# Altium schematic sheet [10]-LPDDR4 SDRAM-2.SchDoc: RK3399 SOM Board Design V1.0
size A3; Author: ABC; Organization: Altium Limited; Address1: L3, 12a Rodborough Rd; Address2: Frenchs Forest; Address3: NSW; Address4: Australia 2086; DocumentNumber: 12; SheetNumber: 12; SheetTotal: 21; PROJECT CODE: A_V1.0
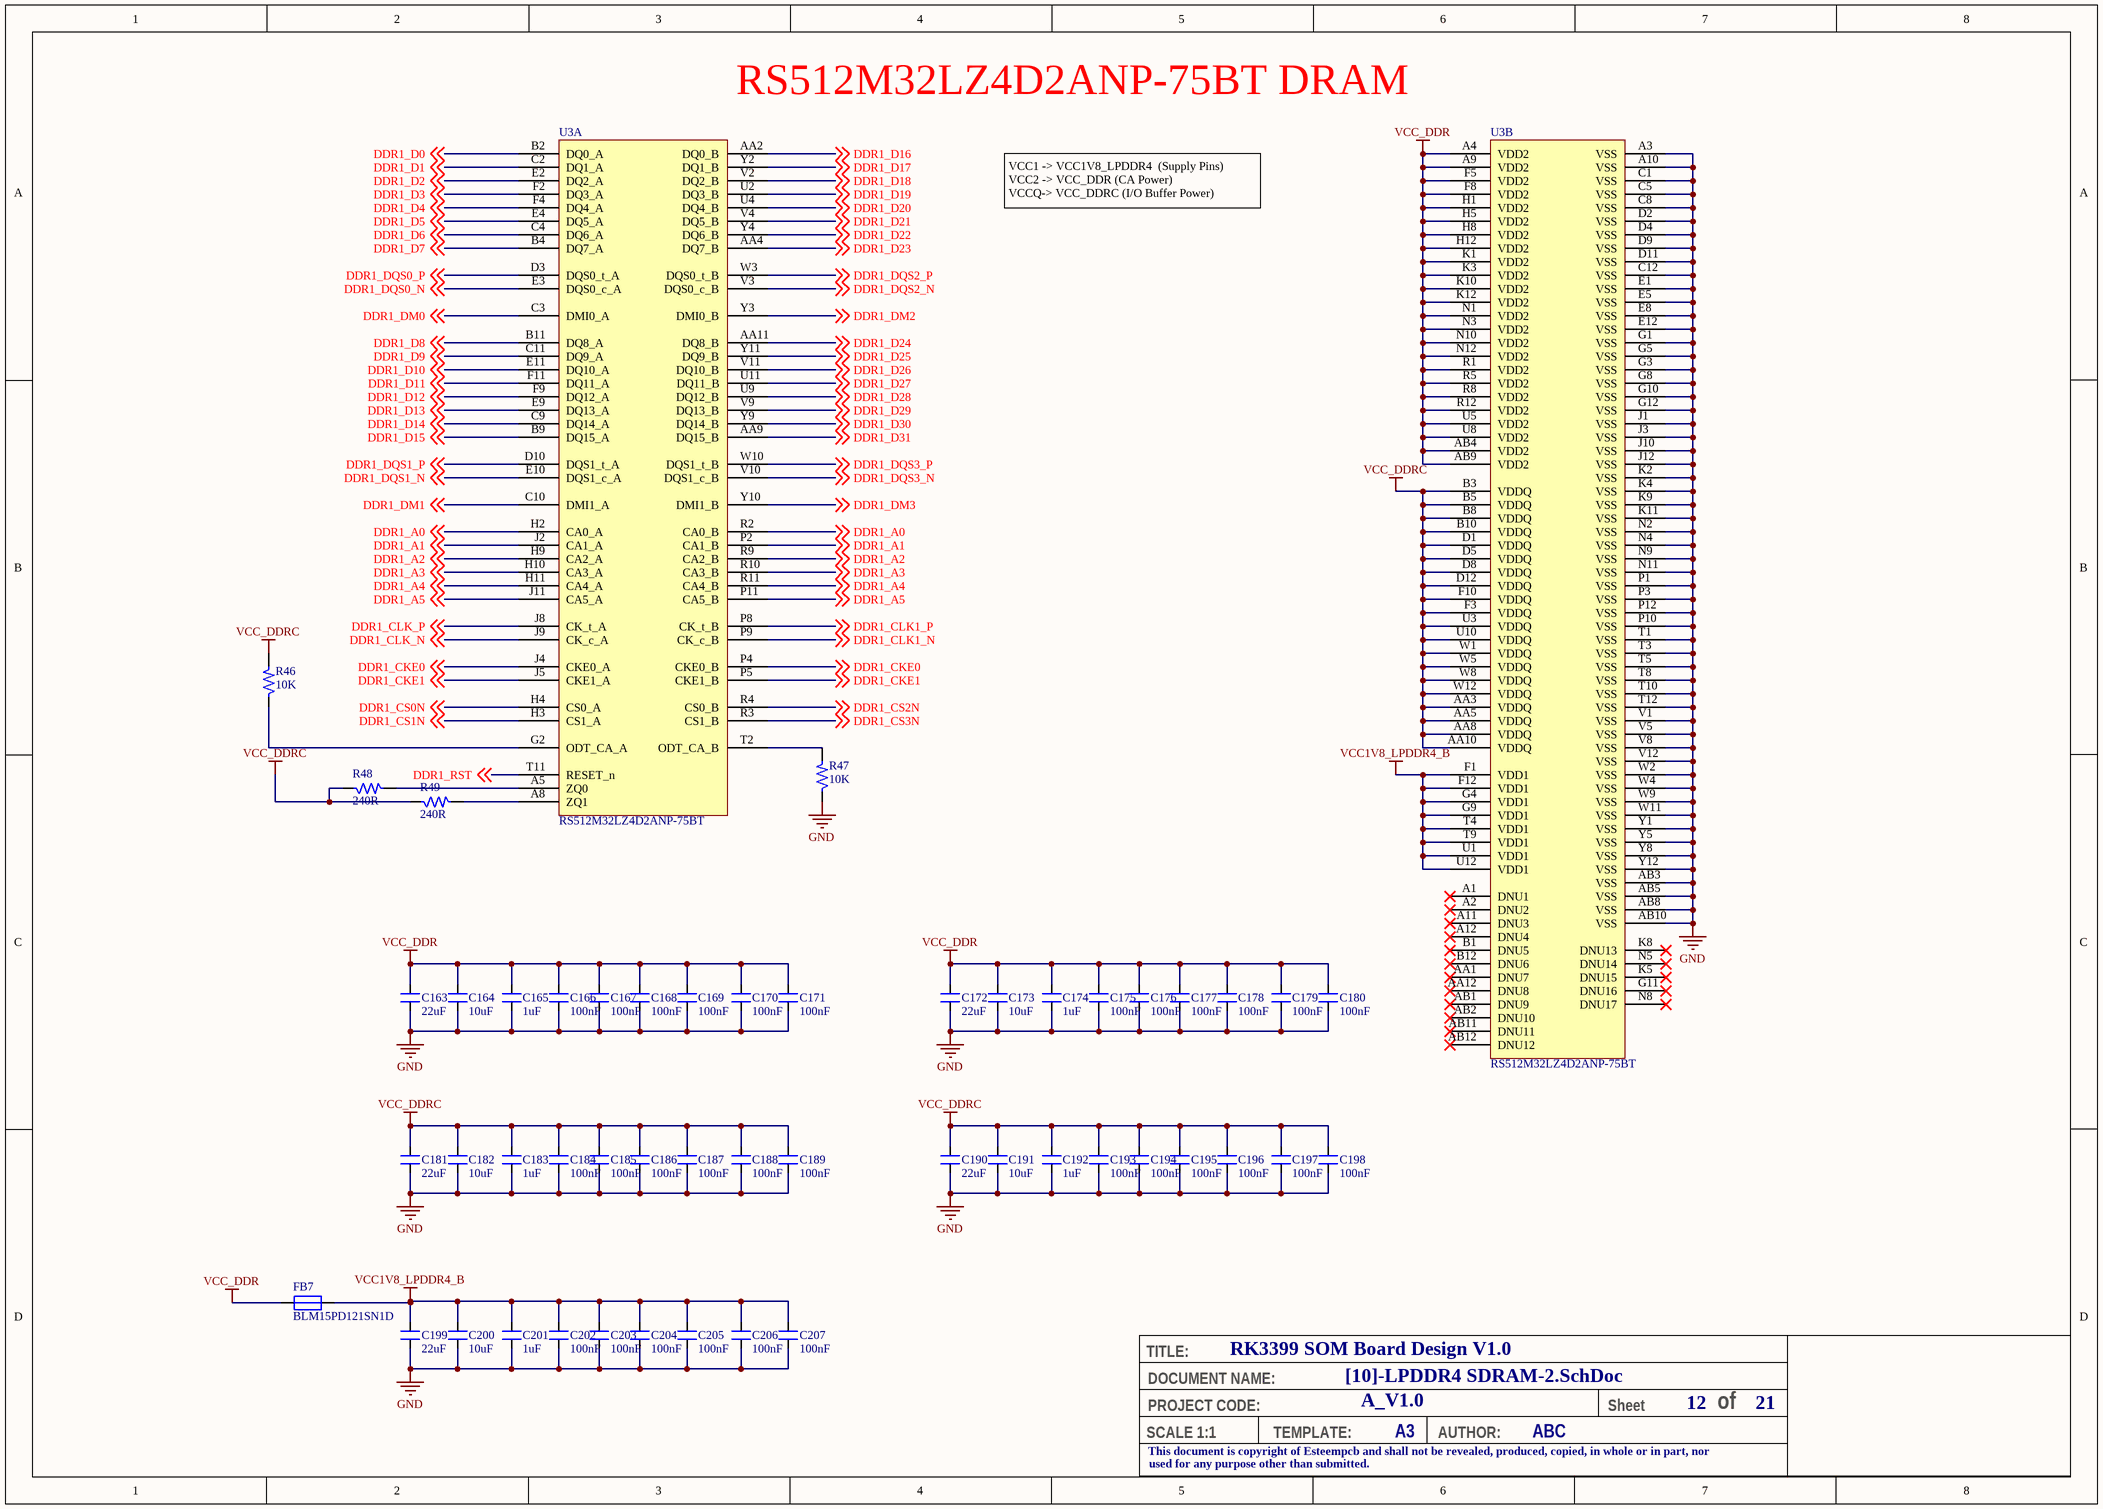
[diagram p0: [10]-LPDDR4 SDRAM-2.SchDoc]

## Parts
C163  22uF  [CAP_0402]
C164  10uF  [CAP_0402]
C165  1uF  [CAP_0201]
C166  100nF  [CAP_0201]
C167  100nF  [CAP_0201]
C168  100nF  [CAP_0201]
C169  100nF  [CAP_0201]
C170  100nF  [CAP_0201]
C171  100nF  [CAP_0201]
C172  22uF  [CAP_0402]
C173  10uF  [CAP_0402]
C174  1uF  [CAP_0201]
C175  100nF  [CAP_0201]
C176  100nF  [CAP_0201]
C177  100nF  [CAP_0201]
C178  100nF  [CAP_0201]
C179  100nF  [CAP_0201]
C180  100nF  [CAP_0201]
C181  22uF  [CAP_0402]
C182  10uF  [CAP_0402]
C183  1uF  [CAP_0201]
C184  100nF  [CAP_0201]
C185  100nF  [CAP_0201]
C186  100nF  [CAP_0201]
C187  100nF  [CAP_0201]
C188  100nF  [CAP_0201]
C189  100nF  [CAP_0201]
C190  22uF  [CAP_0402]
C191  10uF  [CAP_0402]
C192  1uF  [CAP_0201]
C193  100nF  [CAP_0201]
C194  100nF  [CAP_0201]
C195  100nF  [CAP_0201]
C196  100nF  [CAP_0201]
C197  100nF  [CAP_0201]
C198  100nF  [CAP_0201]
C199  22uF  [CAP_0402]
C200  10uF  [CAP_0402]
C201  1uF  [CAP_0201]
C202  100nF  [CAP_0201]
C203  100nF  [CAP_0201]
C204  100nF  [CAP_0201]
C205  100nF  [CAP_0201]
C206  100nF  [CAP_0201]
C207  100nF  [CAP_0201]
FB7  BLM15PD121SN1D  [RES_0402]
R46  10K  [RES_0201]
R47  10K  [RES_0201]
R48  240R  [RES_0201]
R49  240R  [RES_0201]
U3  RS512M32LZ4D2ANP-75BT  [FBGA200_SMD]  (parts A,B of 2)

## Nets
GND: C163.1 C164.1 C165.1 C166.1 C167.1 C168.1 C169.1 C170.1 C171.1 C172.1 C173.1 C174.1 C175.1 C176.1 C177.1 C178.1 C179.1 C180.1 C181.1 C182.1 C183.1 C184.1 C185.1 C186.1 C187.1 C188.1 C189.1 C190.1 C191.1 C192.1 C193.1 C194.1 C195.1 C196.1 C197.1 C198.1 C199.1 C200.1 C201.1 C202.1 C203.1 C204.1 C205.1 C206.1 C207.1 R47.1 U3.A3(VSS) U3.A10(VSS) U3.AB3(VSS) U3.AB5(VSS) U3.AB8(VSS) U3.AB10(VSS) U3.C1(VSS) U3.C5(VSS) U3.C8(VSS) U3.C12(VSS) U3.D2(VSS) U3.D4(VSS) U3.D9(VSS) U3.D11(VSS) U3.E1(VSS) U3.E5(VSS) U3.E8(VSS) U3.E12(VSS) U3.G1(VSS) U3.G3(VSS) U3.G5(VSS) U3.G8(VSS) U3.G10(VSS) U3.G12(VSS) U3.J1(VSS) U3.J3(VSS) U3.J10(VSS) U3.J12(VSS) U3.K2(VSS) U3.K4(VSS) U3.K9(VSS) U3.K11(VSS) U3.N2(VSS) U3.N4(VSS) U3.N9(VSS) U3.N11(VSS) U3.P1(VSS) U3.P3(VSS) U3.P10(VSS) U3.P12(VSS) U3.T1(VSS) U3.T3(VSS) U3.T5(VSS) U3.T8(VSS) U3.T10(VSS) U3.T12(VSS) U3.V1(VSS) U3.V5(VSS) U3.V8(VSS) U3.V12(VSS) U3.W2(VSS) U3.W4(VSS) U3.W9(VSS) U3.W11(VSS) U3.Y1(VSS) U3.Y5(VSS) U3.Y8(VSS) U3.Y12(VSS)
VCC1V8_LPDDR4_B: C199.2 C200.2 C201.2 C202.2 C203.2 C204.2 C205.2 C206.2 C207.2 FB7.2 U3.F1(VDD1) U3.F12(VDD1) U3.G4(VDD1) U3.G9(VDD1) U3.T4(VDD1) U3.T9(VDD1) U3.U1(VDD1) U3.U12(VDD1)
VCC_DDR: C163.2 C164.2 C165.2 C166.2 C167.2 C168.2 C169.2 C170.2 C171.2 C172.2 C173.2 C174.2 C175.2 C176.2 C177.2 C178.2 C179.2 C180.2 FB7.1 U3.A4(VDD2) U3.A9(VDD2) U3.AB4(VDD2) U3.AB9(VDD2) U3.F5(VDD2) U3.F8(VDD2) U3.H1(VDD2) U3.H5(VDD2) U3.H8(VDD2) U3.H12(VDD2) U3.K1(VDD2) U3.K3(VDD2) U3.K10(VDD2) U3.K12(VDD2) U3.N1(VDD2) U3.N3(VDD2) U3.N10(VDD2) U3.N12(VDD2) U3.R1(VDD2) U3.R5(VDD2) U3.R8(VDD2) U3.R12(VDD2) U3.U5(VDD2) U3.U8(VDD2)
VCC_DDRC: C181.2 C182.2 C183.2 C184.2 C185.2 C186.2 C187.2 C188.2 C189.2 C190.2 C191.2 C192.2 C193.2 C194.2 C195.2 C196.2 C197.2 C198.2 R46.2 R48.1 R49.1 U3.AA3(VDDQ) U3.AA5(VDDQ) U3.AA8(VDDQ) U3.AA10(VDDQ) U3.B3(VDDQ) U3.B5(VDDQ) U3.B8(VDDQ) U3.B10(VDDQ) U3.D1(VDDQ) U3.D5(VDDQ) U3.D8(VDDQ) U3.D12(VDDQ) U3.F3(VDDQ) U3.F10(VDDQ) U3.U3(VDDQ) U3.U10(VDDQ) U3.W1(VDDQ) U3.W5(VDDQ) U3.W8(VDDQ) U3.W12(VDDQ)
DDR1_A0: U3.H2(CA0_A) U3.R2(CA0_B) ; off-sheet DDR1_A0
DDR1_A1: U3.J2(CA1_A) U3.P2(CA1_B) ; off-sheet DDR1_A1
DDR1_A2: U3.H9(CA2_A) U3.R9(CA2_B) ; off-sheet DDR1_A2
DDR1_A3: U3.H10(CA3_A) U3.R10(CA3_B) ; off-sheet DDR1_A3
DDR1_A4: U3.H11(CA4_A) U3.R11(CA4_B) ; off-sheet DDR1_A4
DDR1_A5: U3.J11(CA5_A) U3.P11(CA5_B) ; off-sheet DDR1_A5
DDR1_CKE0: U3.J4(CKE0_A) U3.P4(CKE0_B) ; off-sheet DDR1_CKE0
DDR1_CKE1: U3.J5(CKE1_A) U3.P5(CKE1_B) ; off-sheet DDR1_CKE1
DDR1_CLK1_N: U3.P9(CK_c_B) ; off-sheet DDR1_CLK1_N
DDR1_CLK1_P: U3.P8(CK_t_B) ; off-sheet DDR1_CLK1_P
DDR1_CLK_N: U3.J9(CK_c_A) ; off-sheet DDR1_CLK_N
DDR1_CLK_P: U3.J8(CK_t_A) ; off-sheet DDR1_CLK_P
DDR1_CS0N: U3.H4(CS0_A) ; off-sheet DDR1_CS0N
DDR1_CS1N: U3.H3(CS1_A) ; off-sheet DDR1_CS1N
DDR1_CS2N: U3.R4(CS0_B) ; off-sheet DDR1_CS2N
DDR1_CS3N: U3.R3(CS1_B) ; off-sheet DDR1_CS3N
DDR1_D0: U3.B2(DQ0_A) ; off-sheet DDR1_D0
DDR1_D1: U3.C2(DQ1_A) ; off-sheet DDR1_D1
DDR1_D2: U3.E2(DQ2_A) ; off-sheet DDR1_D2
DDR1_D3: U3.F2(DQ3_A) ; off-sheet DDR1_D3
DDR1_D4: U3.F4(DQ4_A) ; off-sheet DDR1_D4
DDR1_D5: U3.E4(DQ5_A) ; off-sheet DDR1_D5
DDR1_D6: U3.C4(DQ6_A) ; off-sheet DDR1_D6
DDR1_D7: U3.B4(DQ7_A) ; off-sheet DDR1_D7
DDR1_D8: U3.B11(DQ8_A) ; off-sheet DDR1_D8
DDR1_D9: U3.C11(DQ9_A) ; off-sheet DDR1_D9
DDR1_D10: U3.E11(DQ10_A) ; off-sheet DDR1_D10
DDR1_D11: U3.F11(DQ11_A) ; off-sheet DDR1_D11
DDR1_D12: U3.F9(DQ12_A) ; off-sheet DDR1_D12
DDR1_D13: U3.E9(DQ13_A) ; off-sheet DDR1_D13
DDR1_D14: U3.C9(DQ14_A) ; off-sheet DDR1_D14
DDR1_D15: U3.B9(DQ15_A) ; off-sheet DDR1_D15
DDR1_D16: U3.AA2(DQ0_B) ; off-sheet DDR1_D16
DDR1_D17: U3.Y2(DQ1_B) ; off-sheet DDR1_D17
DDR1_D18: U3.V2(DQ2_B) ; off-sheet DDR1_D18
DDR1_D19: U3.U2(DQ3_B) ; off-sheet DDR1_D19
DDR1_D20: U3.U4(DQ4_B) ; off-sheet DDR1_D20
DDR1_D21: U3.V4(DQ5_B) ; off-sheet DDR1_D21
DDR1_D22: U3.Y4(DQ6_B) ; off-sheet DDR1_D22
DDR1_D23: U3.AA4(DQ7_B) ; off-sheet DDR1_D23
DDR1_D24: U3.AA11(DQ8_B) ; off-sheet DDR1_D24
DDR1_D25: U3.Y11(DQ9_B) ; off-sheet DDR1_D25
DDR1_D26: U3.V11(DQ10_B) ; off-sheet DDR1_D26
DDR1_D27: U3.U11(DQ11_B) ; off-sheet DDR1_D27
DDR1_D28: U3.U9(DQ12_B) ; off-sheet DDR1_D28
DDR1_D29: U3.V9(DQ13_B) ; off-sheet DDR1_D29
DDR1_D30: U3.Y9(DQ14_B) ; off-sheet DDR1_D30
DDR1_D31: U3.AA9(DQ15_B) ; off-sheet DDR1_D31
DDR1_DM0: U3.C3(DMI0_A) ; off-sheet DDR1_DM0
DDR1_DM1: U3.C10(DMI1_A) ; off-sheet DDR1_DM1
DDR1_DM2: U3.Y3(DMI0_B) ; off-sheet DDR1_DM2
DDR1_DM3: U3.Y10(DMI1_B) ; off-sheet DDR1_DM3
DDR1_DQS0_N: U3.E3(DQS0_c_A) ; off-sheet DDR1_DQS0_N
DDR1_DQS0_P: U3.D3(DQS0_t_A) ; off-sheet DDR1_DQS0_P
DDR1_DQS1_N: U3.E10(DQS1_c_A) ; off-sheet DDR1_DQS1_N
DDR1_DQS1_P: U3.D10(DQS1_t_A) ; off-sheet DDR1_DQS1_P
DDR1_DQS2_N: U3.V3(DQS0_c_B) ; off-sheet DDR1_DQS2_N
DDR1_DQS2_P: U3.W3(DQS0_t_B) ; off-sheet DDR1_DQS2_P
DDR1_DQS3_N: U3.V10(DQS1_c_B) ; off-sheet DDR1_DQS3_N
DDR1_DQS3_P: U3.W10(DQS1_t_B) ; off-sheet DDR1_DQS3_P
DDR1_RST: U3.T11(RESET_n) ; off-sheet DDR1_RST
NetR46_1: R46.1 U3.G2(ODT_CA_A)
NetR47_2: R47.2 U3.T2(ODT_CA_B)
NetR48_2: R48.2 U3.A5(ZQ0)
NetR49_2: R49.2 U3.A8(ZQ1)

Not connected (* = marked no-connect by the designer): U3 A1(DNU1)* A2(DNU2)* A11(DNU3)* A12(DNU4)* AA1(DNU7)* AA12(DNU8)* AB1(DNU9)* AB2(DNU10)* AB11(DNU11)* AB12(DNU12)* B1(DNU5)* B12(DNU6)* G11(DNU16)* K5(DNU15)* K8(DNU13)* N5(DNU14)* N8(DNU17)*

## Notes on the sheet
- (near U3) RS512M32LZ4D2ANP-75BT DRAM
- VCC1 -> VCC1V8_LPDDR4  (Supply Pins)
  VCC2 -> VCC_DDR (CA Power)
  VCCQ-> VCC_DDRC (I/O Buffer Power)
- TITLE:
- DOCUMENT NAME:
- SCALE 1:1
- This document is copyright of Esteempcb and shall not be revealed, produced, copied, in whole or in part, nor
- PROJECT CODE:
- TEMPLATE:
- A3
- AUTHOR:
- Sheet
- of
- used for any purpose other than submitted.

## Library data of the parts
C163 C172 C181 C190 C199 = CAP_22uF-6.3V-20%-0402: 22µF ±20% 6.3V Ceramic Capacitor X5R 0402 (1005 Metric) /; Manufacturer: Murata Electronics; Manufacturer Part Number: CL05A226MQ5N6J8; Case/Package: 0402; Supplier-1: Digikey
C164 C173 C182 C191 C200 = CAP_10uF-10V-20%-0402: 10µF ±20% 10V Ceramic Capacitor X5R 0402 (1005 Metric) /; Manufacturer Part Number: CL05A106MP5NUNC; Manufacturer: Samsung Electro-Mechanics; Case/Package: 0402; Supplier-1: Digikey
C165 C174 C183 C192 C201 = CAP_1uF-16V-10%-0201: 1µF ±20% 16V Ceramic Capacitor X5R 0201 (0603 Metric) /; Manufacturer: Samsung Electro-Mechanics; Manufacturer Part Number: CL03A105MO3NRNH; Case/Package: 0201; Supplier-1: Digikey
C166-C171 C175-C180 C184-C189 C193-C198 C202-C207 = CAP_100nF-25V-10%-0201: 0.1µF ±10% 25V Ceramic Capacitor X5R 0201 (0603 Metric) /; Manufacturer: TDK Corporation; Manufacturer Part Number: C0603X5R1E104K030BB; Case/Package: 0201; Supplier-1: Digikey
FB7 = FB_120R-1.3A-100Mhz-0402: 120 Ohms @ 100MHz 1 Power Line Ferrite Bead 0402 (1005 Metric) 1.3A 90mOhm; Manufacturer: Murata Electronics; Mnaufacturer Part Number: BLM15PD121SN1D; Case/Package: 0402; Supplier-1: Digikey
R46 R47 = RES_10K-0.05W-1%-0201: 10 kOhms ±1% 0.05W, 1/20W Chip Resistor 0201 (0603 Metric) Thick Film /; Manufacturer: Stackpole Electronics Inc; Manufacturer Part Number: RMCF0201FT10K0; Case/Package: 0201; Supplier-1: Digikey
R48 R49 = RES_240R-0.05W-1%-0201: 240 Ohms ±1% 0.05W, 1/20W Chip Resistor 0201 (0603 Metric) Thick Film /; Manufacturer: Yageo; Manufacturer Part Number: RC0201FR-07240RL; Case/Package: 0201; Supplier-1: Digikey
U3 = IC_RS512M32LZ4D2ANP-75BT: LPDDR4/4X Package FBGA 200b Density 4Gbit~64Gbit Operating Temperature Range：-25~85℃ Speed：2667Mbps/3200Mbps/3733Mbps Voltage：VDD1/VDD2/VDDQ= 1.8 / 1.1 / 1.1 V（LPDDR4）VDD1/VDD2/VDDQ = 1.8 / 1.1 / 0.6 V（LPDDR4X）Approved Verification Platform：MTK、Spreadtrum; Manufacturer: RAYSON; Manufacturer Part Number: RS512M32LZ4D2ANP-75BT; Case/Package: FBGA 200b; Supplier-1: RAYSON